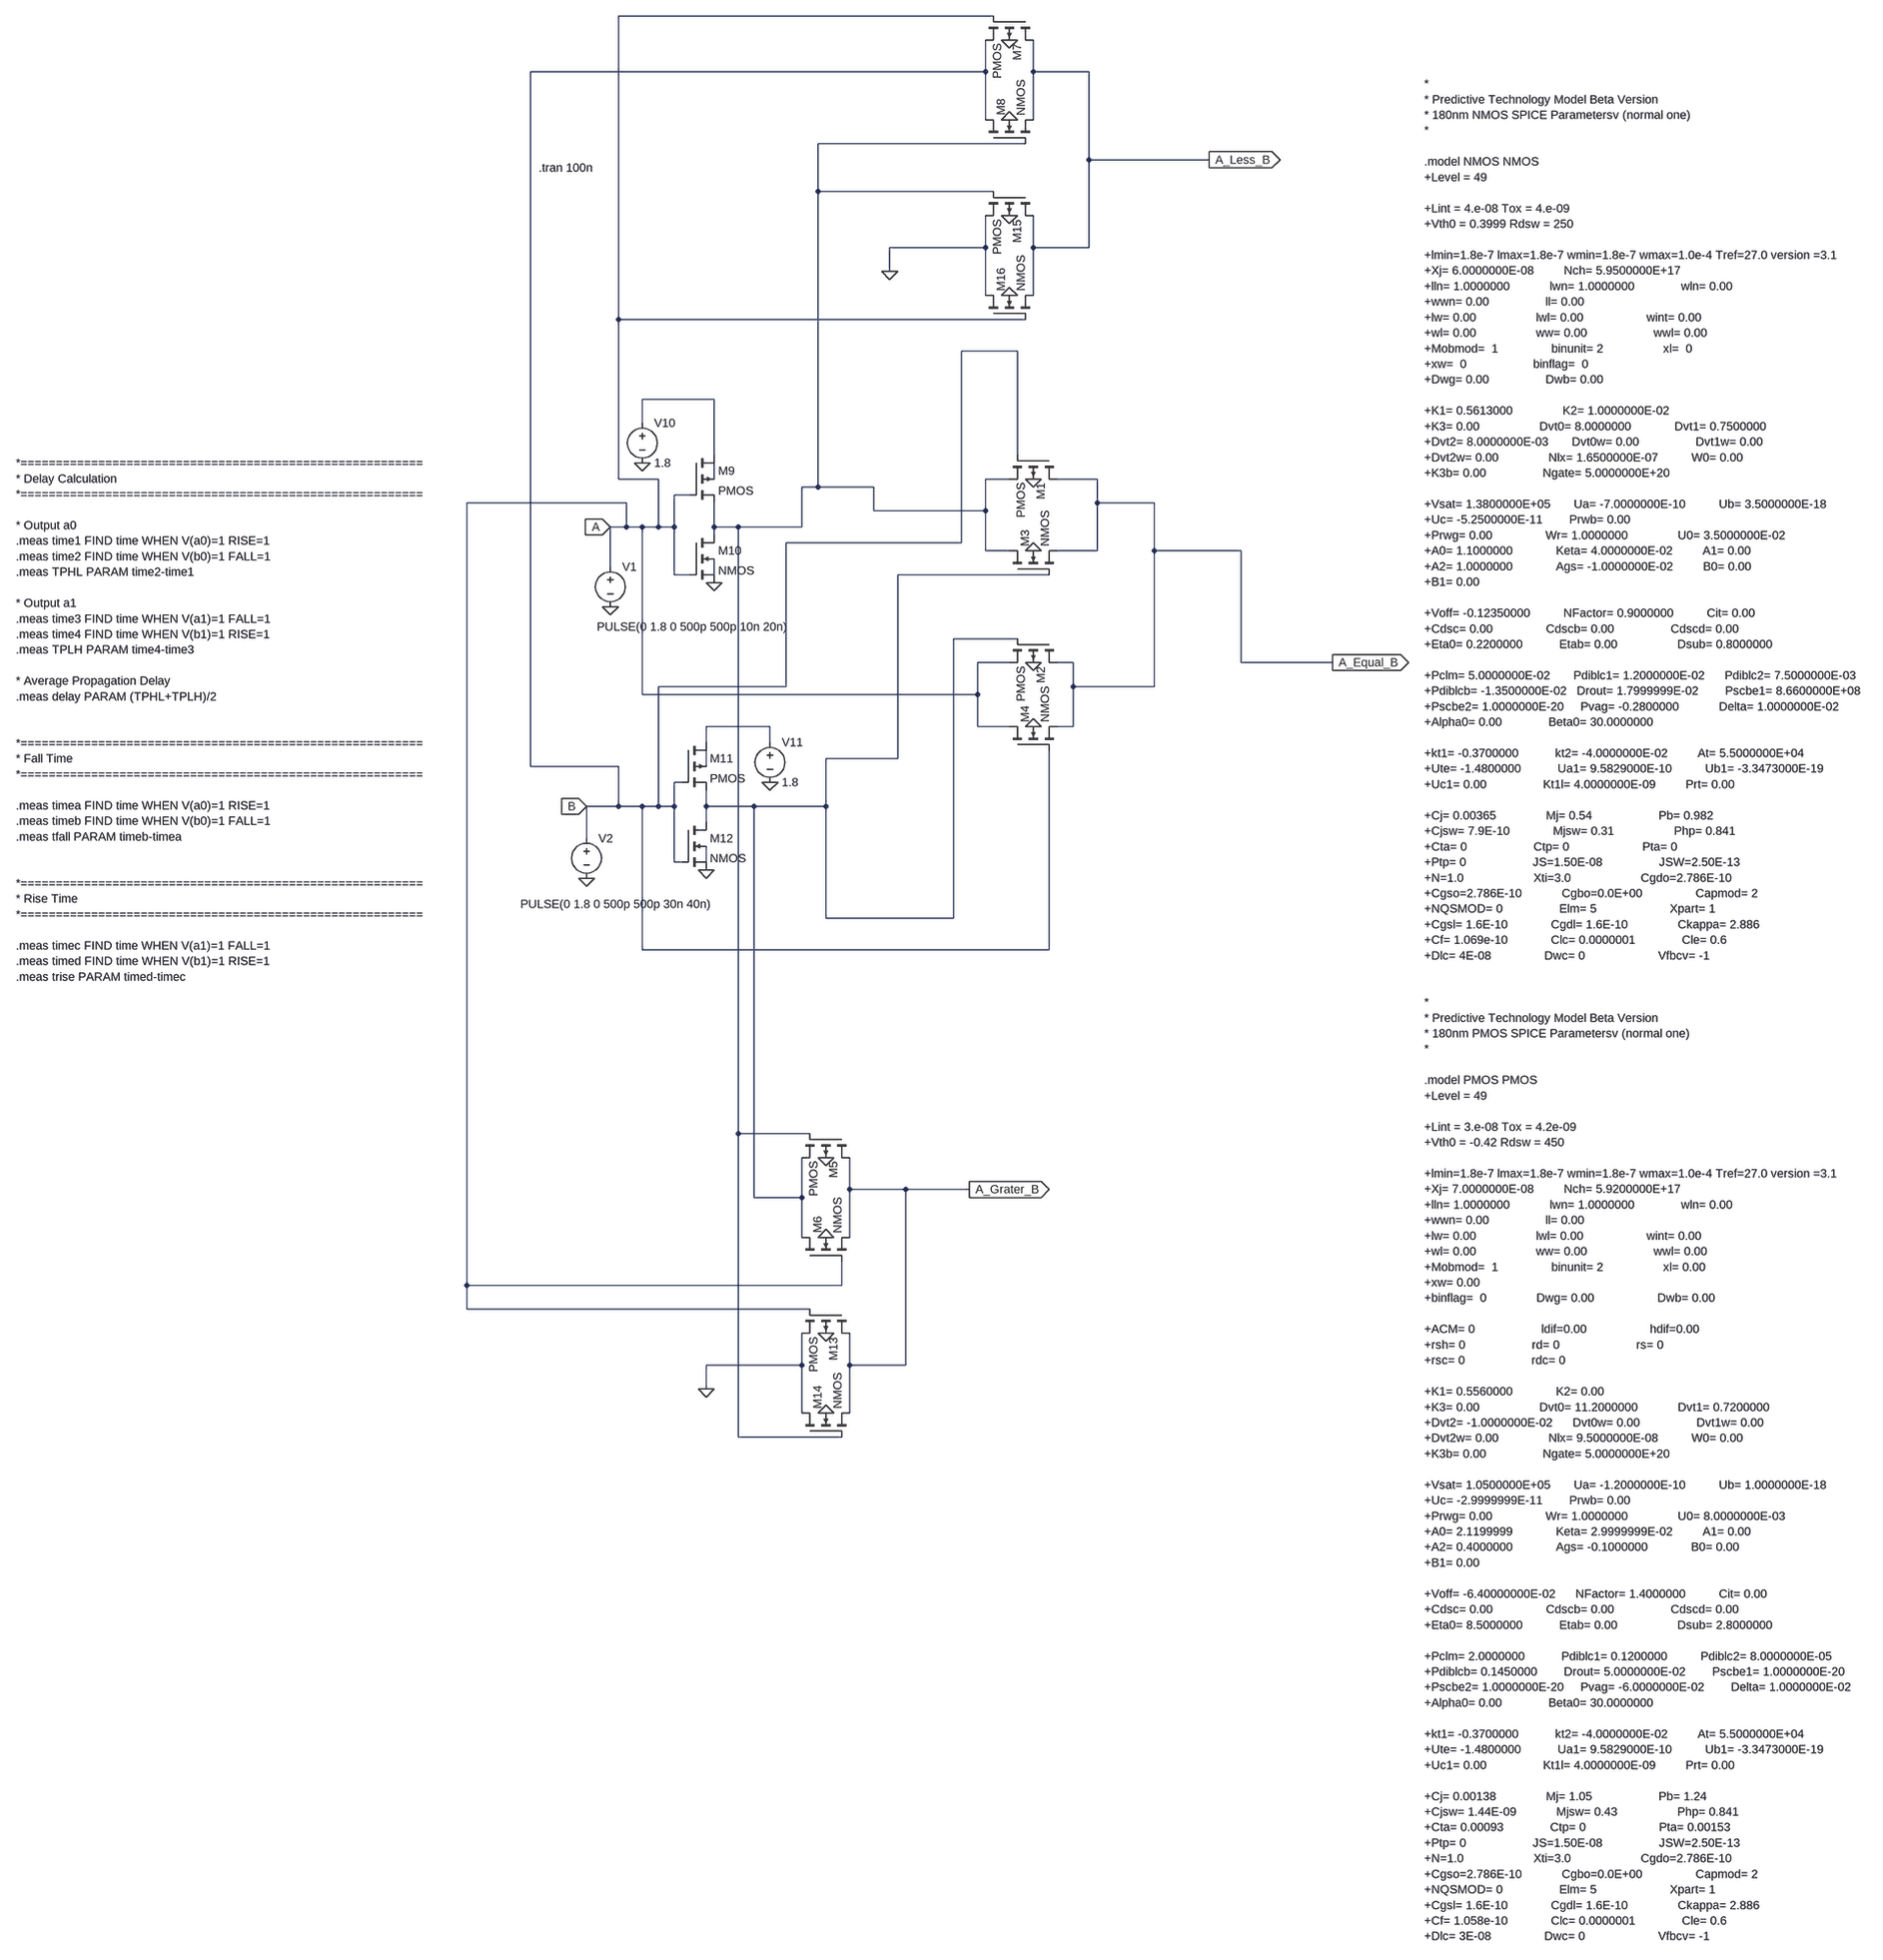
[diagram p0: schematic Comparator-tg-180nm.asc]
Comparator-tg-180nm.asc, the LTspice schematic file:
Version 4
SHEET 1 2256 1880
WIRE 160 -976 -592 -976
WIRE 144 -864 144 -928
WIRE 144 -864 -768 -864
WIRE 240 -864 240 -928
WIRE 352 -864 240 -864
WIRE 144 -768 144 -864
WIRE 240 -768 240 -864
WIRE 224 -720 -192 -720
WIRE 352 -688 352 -864
WIRE 816 -688 352 -688
WIRE -192 -624 -192 -720
WIRE 160 -624 -192 -624
WIRE 144 -512 144 -576
WIRE 144 -512 -48 -512
WIRE 240 -512 240 -576
WIRE 352 -512 352 -688
WIRE 352 -512 240 -512
WIRE -48 -464 -48 -512
WIRE 144 -416 144 -512
WIRE 240 -416 240 -512
WIRE -592 -368 -592 -976
WIRE 224 -368 -592 -368
WIRE 208 -304 96 -304
WIRE -400 -208 -544 -208
WIRE -544 -160 -544 -208
WIRE -400 -96 -400 -208
WIRE 208 -96 208 -304
WIRE -592 -48 -592 -368
WIRE -512 -48 -592 -48
WIRE -400 -48 -400 -80
WIRE 192 -48 144 -48
WIRE 368 -48 288 -48
WIRE -192 -32 -192 -624
WIRE -192 -32 -224 -32
WIRE -80 -32 -192 -32
WIRE -448 -16 -480 -16
WIRE -576 0 -896 0
WIRE 368 0 368 -48
WIRE 496 0 368 0
WIRE -80 16 -80 -32
WIRE 144 16 144 -48
WIRE 144 16 -80 16
WIRE -576 48 -576 0
WIRE -576 48 -608 48
WIRE -544 48 -576 48
WIRE -512 48 -512 -48
WIRE -512 48 -544 48
WIRE -480 48 -480 -16
WIRE -480 48 -512 48
WIRE -400 48 -400 0
WIRE -352 48 -400 48
WIRE -224 48 -224 -32
WIRE -224 48 -352 48
WIRE -400 64 -400 48
WIRE 96 80 96 -304
WIRE 96 80 -256 80
WIRE 144 96 144 16
WIRE 192 96 144 96
WIRE 368 96 368 0
WIRE 368 96 288 96
WIRE 496 96 496 0
WIRE 880 96 496 96
WIRE -608 128 -608 48
WIRE -480 144 -480 48
WIRE -448 144 -480 144
WIRE -400 144 -400 112
WIRE 272 144 -32 144
WIRE 208 272 80 272
WIRE 192 320 128 320
WIRE 320 320 288 320
WIRE 880 320 880 96
WIRE 1312 320 880 320
WIRE -256 368 -256 80
WIRE -256 368 -512 368
WIRE 320 368 320 320
WIRE 496 368 496 96
WIRE 496 368 320 368
WIRE -544 384 -544 48
WIRE 128 384 128 320
WIRE 128 384 -544 384
WIRE -288 448 -416 448
WIRE 128 448 128 384
WIRE 192 448 128 448
WIRE 320 448 320 368
WIRE 320 448 288 448
WIRE -416 480 -416 448
WIRE -288 480 -288 448
WIRE -32 512 -32 144
WIRE -32 512 -176 512
WIRE -768 528 -768 -864
WIRE -592 528 -768 528
WIRE -416 528 -416 496
WIRE -464 560 -480 560
WIRE -592 608 -592 528
WIRE -592 608 -656 608
WIRE -544 608 -592 608
WIRE -512 608 -512 368
WIRE -512 608 -544 608
WIRE -480 608 -480 560
WIRE -480 608 -512 608
WIRE -416 608 -416 576
WIRE -320 608 -416 608
WIRE -176 608 -176 512
WIRE -176 608 -320 608
WIRE -416 640 -416 608
WIRE -656 672 -656 608
WIRE -480 720 -480 608
WIRE -464 720 -480 720
WIRE -416 720 -416 688
WIRE -176 832 -176 608
WIRE 80 832 80 272
WIRE 80 832 -176 832
WIRE -544 896 -544 608
WIRE 272 896 272 496
WIRE 272 896 -544 896
WIRE -352 1264 -352 48
WIRE -208 1264 -352 1264
WIRE -128 1376 -128 1312
WIRE -16 1376 -128 1376
WIRE 112 1376 -16 1376
WIRE -320 1392 -320 608
WIRE -224 1392 -224 1312
WIRE -224 1392 -320 1392
WIRE -224 1472 -224 1392
WIRE -128 1472 -128 1376
WIRE -896 1568 -896 0
WIRE -144 1568 -144 1520
WIRE -144 1568 -896 1568
WIRE -896 1616 -896 1568
WIRE -208 1616 -896 1616
WIRE -224 1728 -224 1664
WIRE -224 1728 -416 1728
WIRE -128 1728 -128 1664
WIRE -16 1728 -16 1376
WIRE -16 1728 -128 1728
WIRE -416 1776 -416 1728
WIRE -224 1824 -224 1728
WIRE -128 1824 -128 1728
WIRE -352 1872 -352 1264
WIRE -144 1872 -352 1872
FLAG -416 736 0
FLAG -400 160 0
FLAG -608 208 0
FLAG -656 752 0
FLAG -608 48 A
IOPIN -608 48 In
FLAG -656 608 B
IOPIN -656 608 In
FLAG 816 -688 A_Less_B
IOPIN 816 -688 Out
FLAG -544 -80 0
FLAG -288 560 0
FLAG 112 1376 A_Grater_B
IOPIN 112 1376 Out
FLAG 1312 320 A_Equal_B
IOPIN 1312 320 Out
FLAG -416 1776 0
FLAG -48 -464 0
FLAG 192 -928 0
FLAG 192 -768 0
FLAG 192 -576 0
FLAG 192 -416 0
FLAG -176 1824 0
FLAG -176 1664 0
FLAG -176 1472 0
FLAG -176 1312 0
FLAG 240 -48 0
FLAG 240 96 0
FLAG 240 320 0
FLAG 240 448 0
SYMBOL pmos4 -448 -96 R0
SYMATTR InstName M9
SYMATTR Value2 l=180nm w=540nm
SYMBOL nmos4 -448 64 R0
SYMATTR InstName M10
SYMATTR Value2 l=180nm w=540nm
SYMBOL pmos4 -464 480 R0
SYMATTR InstName M11
SYMATTR Value2 l=180nm w=540nm
SYMBOL nmos4 -464 640 R0
SYMATTR InstName M12
SYMATTR Value2 l=180nm w=540nm
SYMBOL voltage -608 112 R0
WINDOW 3 -27 136 Left 2
WINDOW 123 0 0 Left 0
WINDOW 39 0 0 Left 0
SYMATTR Value PULSE(0 1.8 0 500p 500p 10n 20n)
SYMATTR InstName V1
SYMBOL voltage -656 656 R0
WINDOW 3 -132 148 Left 2
WINDOW 123 0 0 Left 0
WINDOW 39 0 0 Left 0
SYMATTR Value PULSE(0 1.8 0 500p 500p 30n 40n)
SYMATTR InstName V2
SYMBOL voltage -544 -176 R0
WINDOW 123 0 0 Left 0
WINDOW 39 0 0 Left 0
SYMATTR InstName V10
SYMATTR Value 1.8
SYMBOL voltage -288 464 R0
WINDOW 123 0 0 Left 0
WINDOW 39 0 0 Left 0
SYMATTR InstName V11
SYMATTR Value 1.8
SYMBOL pmos4 288 -96 R90
SYMATTR InstName M1
SYMATTR Value2 l=180nm w=540nm
SYMBOL pmos4 288 272 R90
SYMATTR InstName M2
SYMATTR Value2 l=180nm w=540nm
SYMBOL nmos4 192 144 R270
SYMATTR InstName M3
SYMATTR Value2 l=180nm w=540nm
SYMBOL nmos4 192 496 R270
SYMATTR InstName M4
SYMATTR Value2 l=180nm w=540nm
SYMBOL pmos4 -128 1264 R90
SYMATTR InstName M5
SYMATTR Value2 l=180nm w=540nm
SYMBOL nmos4 -224 1520 R270
SYMATTR InstName M6
SYMATTR Value2 l=180nm w=540nm
SYMBOL pmos4 -128 1616 R90
SYMATTR InstName M13
SYMATTR Value2 l=180nm w=540nm
SYMBOL nmos4 -224 1872 R270
SYMATTR InstName M14
SYMATTR Value2 l=180nm w=540nm
SYMBOL pmos4 240 -976 R90
SYMATTR InstName M7
SYMATTR Value2 l=180nm w=540nm
SYMBOL nmos4 144 -720 R270
SYMATTR InstName M8
SYMATTR Value2 l=180nm w=540nm
SYMBOL pmos4 240 -624 R90
SYMATTR InstName M15
SYMATTR Value2 l=180nm w=540nm
SYMBOL nmos4 144 -368 R270
SYMATTR InstName M16
SYMATTR Value2 l=180nm w=540nm
TEXT -752 -672 Left 2 !.tran 100n
TEXT -1800 -80 Left 2 !*=========================================================\n* Delay Calculation\n*=========================================================\n \n* Output a0\n.meas time1 FIND time WHEN V(a0)=1 RISE=1\n.meas time2 FIND time WHEN V(b0)=1 FALL=1\n.meas TPHL PARAM time2-time1\n \n* Output a1\n.meas time3 FIND time WHEN V(a1)=1 FALL=1\n.meas time4 FIND time WHEN V(b1)=1 RISE=1\n.meas TPLH PARAM time4-time3\n \n* Average Propagation Delay\n.meas delay PARAM (TPHL+TPLH)/2\n \n\n*=========================================================\n* Fall Time\n*=========================================================\n \n.meas timea FIND time WHEN V(a0)=1 RISE=1\n.meas timeb FIND time WHEN V(b0)=1 FALL=1\n.meas tfall PARAM timeb-timea\n \n\n*=========================================================\n* Rise Time\n*=========================================================\n \n.meas timec FIND time WHEN V(a1)=1 FALL=1\n.meas timed FIND time WHEN V(b1)=1 RISE=1\n.meas trise PARAM timed-timec
TEXT 1496 -840 Left 2 !*\n* Predictive Technology Model Beta Version\n* 180nm NMOS SPICE Parametersv (normal one)\n*\n \n.model NMOS NMOS\n+Level = 49\n \n+Lint = 4.e-08 Tox = 4.e-09 \n+Vth0 = 0.3999 Rdsw = 250 \n \n+lmin=1.8e-7 lmax=1.8e-7 wmin=1.8e-7 wmax=1.0e-4 Tref=27.0 version =3.1\n+Xj= 6.0000000E-08         Nch= 5.9500000E+17 \n+lln= 1.0000000            lwn= 1.0000000              wln= 0.00\n+wwn= 0.00                 ll= 0.00\n+lw= 0.00                  lwl= 0.00                   wint= 0.00\n+wl= 0.00                  ww= 0.00                    wwl= 0.00\n+Mobmod=  1                binunit= 2                  xl=  0\n+xw=  0                    binflag=  0\n+Dwg= 0.00                 Dwb= 0.00 \n \n+K1= 0.5613000               K2= 1.0000000E-02 \n+K3= 0.00                  Dvt0= 8.0000000             Dvt1= 0.7500000 \n+Dvt2= 8.0000000E-03       Dvt0w= 0.00                 Dvt1w= 0.00 \n+Dvt2w= 0.00               Nlx= 1.6500000E-07          W0= 0.00 \n+K3b= 0.00                 Ngate= 5.0000000E+20 \n \n+Vsat= 1.3800000E+05       Ua= -7.0000000E-10          Ub= 3.5000000E-18 \n+Uc= -5.2500000E-11        Prwb= 0.00 \n+Prwg= 0.00                Wr= 1.0000000               U0= 3.5000000E-02 \n+A0= 1.1000000             Keta= 4.0000000E-02         A1= 0.00 \n+A2= 1.0000000             Ags= -1.0000000E-02         B0= 0.00 \n+B1= 0.00 \n \n+Voff= -0.12350000          NFactor= 0.9000000          Cit= 0.00 \n+Cdsc= 0.00                Cdscb= 0.00                 Cdscd= 0.00 \n+Eta0= 0.2200000           Etab= 0.00                  Dsub= 0.8000000 \n \n+Pclm= 5.0000000E-02       Pdiblc1= 1.2000000E-02      Pdiblc2= 7.5000000E-03 \n+Pdiblcb= -1.3500000E-02   Drout= 1.7999999E-02        Pscbe1= 8.6600000E+08 \n+Pscbe2= 1.0000000E-20     Pvag= -0.2800000            Delta= 1.0000000E-02 \n+Alpha0= 0.00              Beta0= 30.0000000 \n \n+kt1= -0.3700000           kt2= -4.0000000E-02         At= 5.5000000E+04 \n+Ute= -1.4800000           Ua1= 9.5829000E-10          Ub1= -3.3473000E-19 \n+Uc1= 0.00                 Kt1l= 4.0000000E-09         Prt= 0.00 \n \n+Cj= 0.00365               Mj= 0.54                    Pb= 0.982\n+Cjsw= 7.9E-10             Mjsw= 0.31                  Php= 0.841\n+Cta= 0                    Ctp= 0                      Pta= 0\n+Ptp= 0                    JS=1.50E-08                 JSW=2.50E-13\n+N=1.0                     Xti=3.0                     Cgdo=2.786E-10\n+Cgso=2.786E-10            Cgbo=0.0E+00                Capmod= 2\n+NQSMOD= 0                 Elm= 5                      Xpart= 1\n+Cgsl= 1.6E-10             Cgdl= 1.6E-10               Ckappa= 2.886\n+Cf= 1.069e-10             Clc= 0.0000001              Cle= 0.6\n+Dlc= 4E-08                Dwc= 0                      Vfbcv= -1\n \n\n*\n* Predictive Technology Model Beta Version\n* 180nm PMOS SPICE Parametersv (normal one)\n*\n \n.model PMOS PMOS\n+Level = 49\n \n+Lint = 3.e-08 Tox = 4.2e-09 \n+Vth0 = -0.42 Rdsw = 450 \n \n+lmin=1.8e-7 lmax=1.8e-7 wmin=1.8e-7 wmax=1.0e-4 Tref=27.0 version =3.1\n+Xj= 7.0000000E-08         Nch= 5.9200000E+17 \n+lln= 1.0000000            lwn= 1.0000000              wln= 0.00\n+wwn= 0.00                 ll= 0.00\n+lw= 0.00                  lwl= 0.00                   wint= 0.00\n+wl= 0.00                  ww= 0.00                    wwl= 0.00\n+Mobmod=  1                binunit= 2                  xl= 0.00\n+xw= 0.00                  \n+binflag=  0               Dwg= 0.00                   Dwb= 0.00 \n \n+ACM= 0                    ldif=0.00                   hdif=0.00\n+rsh= 0                    rd= 0                       rs= 0\n+rsc= 0                    rdc= 0\n \n+K1= 0.5560000             K2= 0.00 \n+K3= 0.00                  Dvt0= 11.2000000            Dvt1= 0.7200000 \n+Dvt2= -1.0000000E-02      Dvt0w= 0.00                 Dvt1w= 0.00 \n+Dvt2w= 0.00               Nlx= 9.5000000E-08          W0= 0.00 \n+K3b= 0.00                 Ngate= 5.0000000E+20 \n \n+Vsat= 1.0500000E+05       Ua= -1.2000000E-10          Ub= 1.0000000E-18 \n+Uc= -2.9999999E-11        Prwb= 0.00 \n+Prwg= 0.00                Wr= 1.0000000               U0= 8.0000000E-03 \n+A0= 2.1199999             Keta= 2.9999999E-02         A1= 0.00 \n+A2= 0.4000000             Ags= -0.1000000             B0= 0.00 \n+B1= 0.00 \n \n+Voff= -6.40000000E-02      NFactor= 1.4000000          Cit= 0.00 \n+Cdsc= 0.00                Cdscb= 0.00                 Cdscd= 0.00 \n+Eta0= 8.5000000           Etab= 0.00                  Dsub= 2.8000000 \n \n+Pclm= 2.0000000           Pdiblc1= 0.1200000          Pdiblc2= 8.0000000E-05 \n+Pdiblcb= 0.1450000        Drout= 5.0000000E-02        Pscbe1= 1.0000000E-20 \n+Pscbe2= 1.0000000E-20     Pvag= -6.0000000E-02        Delta= 1.0000000E-02 \n+Alpha0= 0.00              Beta0= 30.0000000 \n \n+kt1= -0.3700000           kt2= -4.0000000E-02         At= 5.5000000E+04 \n+Ute= -1.4800000           Ua1= 9.5829000E-10          Ub1= -3.3473000E-19 \n+Uc1= 0.00                 Kt1l= 4.0000000E-09         Prt= 0.00 \n \n+Cj= 0.00138               Mj= 1.05                    Pb= 1.24\n+Cjsw= 1.44E-09            Mjsw= 0.43                  Php= 0.841\n+Cta= 0.00093              Ctp= 0                      Pta= 0.00153\n+Ptp= 0                    JS=1.50E-08                 JSW=2.50E-13\n+N=1.0                     Xti=3.0                     Cgdo=2.786E-10\n+Cgso=2.786E-10            Cgbo=0.0E+00                Capmod= 2\n+NQSMOD= 0                 Elm= 5                      Xpart= 1\n+Cgsl= 1.6E-10             Cgdl= 1.6E-10               Ckappa= 2.886\n+Cf= 1.058e-10             Clc= 0.0000001              Cle= 0.6\n+Dlc= 3E-08                Dwc= 0                      Vfbcv= -1

The netlist it stands for:
* Comparator-tg-180nm.asc
M9 N002 A N001 N003 PMOS l=180nm w=540nm
M10 N001 A 0 N004 NMOS l=180nm w=540nm
M11 N006 B N005 N007 PMOS l=180nm w=540nm
M12 N005 B 0 N008 NMOS l=180nm w=540nm
V1 A 0 PULSE(0 1.8 0 500p 500p 10n 20n)
V2 B 0 PULSE(0 1.8 0 500p 500p 30n 40n)
V10 N002 0 1.8
V11 N006 0 1.8
M1 A_Equal_B B N001 0 PMOS l=180nm w=540nm
M2 A_Equal_B N005 A 0 PMOS l=180nm w=540nm
M3 N001 N005 A_Equal_B 0 NMOS l=180nm w=540nm
M4 A B A_Equal_B 0 NMOS l=180nm w=540nm
M5 A_Grater_B N001 N005 0 PMOS l=180nm w=540nm
M6 N005 A A_Grater_B 0 NMOS l=180nm w=540nm
M13 A_Grater_B A 0 0 PMOS l=180nm w=540nm
M14 0 N001 A_Grater_B 0 NMOS l=180nm w=540nm
M7 A_Less_B A B 0 PMOS l=180nm w=540nm
M8 B N001 A_Less_B 0 NMOS l=180nm w=540nm
M15 A_Less_B N001 0 0 PMOS l=180nm w=540nm
M16 0 A A_Less_B 0 NMOS l=180nm w=540nm
.model NMOS NMOS
.model PMOS PMOS
.lib standard.mos
.tran 100n
*=========================================================
* Delay Calculation
*=========================================================
* Output a0
.meas time1 FIND time WHEN V(a0)=1 RISE=1
.meas time2 FIND time WHEN V(b0)=1 FALL=1
.meas TPHL PARAM time2-time1
* Output a1
.meas time3 FIND time WHEN V(a1)=1 FALL=1
.meas time4 FIND time WHEN V(b1)=1 RISE=1
.meas TPLH PARAM time4-time3
* Average Propagation Delay
.meas delay PARAM (TPHL+TPLH)/2
*=========================================================
* Fall Time
*=========================================================
.meas timea FIND time WHEN V(a0)=1 RISE=1
.meas timeb FIND time WHEN V(b0)=1 FALL=1
.meas tfall PARAM timeb-timea
*=========================================================
* Rise Time
*=========================================================
.meas timec FIND time WHEN V(a1)=1 FALL=1
.meas timed FIND time WHEN V(b1)=1 RISE=1
.meas trise PARAM timed-timec
*
* Predictive Technology Model Beta Version
* 180nm NMOS SPICE Parametersv (normal one)
*
.model NMOS NMOS
+Level = 49
+Lint = 4.e-08 Tox = 4.e-09
+Vth0 = 0.3999 Rdsw = 250
+lmin=1.8e-7 lmax=1.8e-7 wmin=1.8e-7 wmax=1.0e-4 Tref=27.0 version =3.1
+Xj= 6.0000000E-08         Nch= 5.9500000E+17
+lln= 1.0000000            lwn= 1.0000000              wln= 0.00
+wwn= 0.00                 ll= 0.00
+lw= 0.00                  lwl= 0.00                   wint= 0.00
+wl= 0.00                  ww= 0.00                    wwl= 0.00
+Mobmod=  1                binunit= 2                  xl=  0
+xw=  0                    binflag=  0
+Dwg= 0.00                 Dwb= 0.00
+K1= 0.5613000               K2= 1.0000000E-02
+K3= 0.00                  Dvt0= 8.0000000             Dvt1= 0.7500000
+Dvt2= 8.0000000E-03       Dvt0w= 0.00                 Dvt1w= 0.00
+Dvt2w= 0.00               Nlx= 1.6500000E-07          W0= 0.00
+K3b= 0.00                 Ngate= 5.0000000E+20
+Vsat= 1.3800000E+05       Ua= -7.0000000E-10          Ub= 3.5000000E-18
+Uc= -5.2500000E-11        Prwb= 0.00
+Prwg= 0.00                Wr= 1.0000000               U0= 3.5000000E-02
+A0= 1.1000000             Keta= 4.0000000E-02         A1= 0.00
+A2= 1.0000000             Ags= -1.0000000E-02         B0= 0.00
+B1= 0.00
+Voff= -0.12350000          NFactor= 0.9000000          Cit= 0.00
+Cdsc= 0.00                Cdscb= 0.00                 Cdscd= 0.00
+Eta0= 0.2200000           Etab= 0.00                  Dsub= 0.8000000
+Pclm= 5.0000000E-02       Pdiblc1= 1.2000000E-02      Pdiblc2= 7.5000000E-03
+Pdiblcb= -1.3500000E-02   Drout= 1.7999999E-02        Pscbe1= 8.6600000E+08
+Pscbe2= 1.0000000E-20     Pvag= -0.2800000            Delta= 1.0000000E-02
+Alpha0= 0.00              Beta0= 30.0000000
+kt1= -0.3700000           kt2= -4.0000000E-02         At= 5.5000000E+04
+Ute= -1.4800000           Ua1= 9.5829000E-10          Ub1= -3.3473000E-19
+Uc1= 0.00                 Kt1l= 4.0000000E-09         Prt= 0.00
+Cj= 0.00365               Mj= 0.54                    Pb= 0.982
+Cjsw= 7.9E-10             Mjsw= 0.31                  Php= 0.841
+Cta= 0                    Ctp= 0                      Pta= 0
+Ptp= 0                    JS=1.50E-08                 JSW=2.50E-13
+N=1.0                     Xti=3.0                     Cgdo=2.786E-10
+Cgso=2.786E-10            Cgbo=0.0E+00                Capmod= 2
+NQSMOD= 0                 Elm= 5                      Xpart= 1
+Cgsl= 1.6E-10             Cgdl= 1.6E-10               Ckappa= 2.886
+Cf= 1.069e-10             Clc= 0.0000001              Cle= 0.6
+Dlc= 4E-08                Dwc= 0                      Vfbcv= -1
*
* Predictive Technology Model Beta Version
* 180nm PMOS SPICE Parametersv (normal one)
*
.model PMOS PMOS
+Level = 49
+Lint = 3.e-08 Tox = 4.2e-09
+Vth0 = -0.42 Rdsw = 450
+lmin=1.8e-7 lmax=1.8e-7 wmin=1.8e-7 wmax=1.0e-4 Tref=27.0 version =3.1
+Xj= 7.0000000E-08         Nch= 5.9200000E+17
+lln= 1.0000000            lwn= 1.0000000              wln= 0.00
+wwn= 0.00                 ll= 0.00
+lw= 0.00                  lwl= 0.00                   wint= 0.00
+wl= 0.00                  ww= 0.00                    wwl= 0.00
+Mobmod=  1                binunit= 2                  xl= 0.00
+xw= 0.00
+binflag=  0               Dwg= 0.00                   Dwb= 0.00
+ACM= 0                    ldif=0.00                   hdif=0.00
+rsh= 0                    rd= 0                       rs= 0
+rsc= 0                    rdc= 0
+K1= 0.5560000             K2= 0.00
+K3= 0.00                  Dvt0= 11.2000000            Dvt1= 0.7200000
+Dvt2= -1.0000000E-02      Dvt0w= 0.00                 Dvt1w= 0.00
+Dvt2w= 0.00               Nlx= 9.5000000E-08          W0= 0.00
+K3b= 0.00                 Ngate= 5.0000000E+20
+Vsat= 1.0500000E+05       Ua= -1.2000000E-10          Ub= 1.0000000E-18
+Uc= -2.9999999E-11        Prwb= 0.00
+Prwg= 0.00                Wr= 1.0000000               U0= 8.0000000E-03
+A0= 2.1199999             Keta= 2.9999999E-02         A1= 0.00
+A2= 0.4000000             Ags= -0.1000000             B0= 0.00
+B1= 0.00
+Voff= -6.40000000E-02      NFactor= 1.4000000          Cit= 0.00
+Cdsc= 0.00                Cdscb= 0.00                 Cdscd= 0.00
+Eta0= 8.5000000           Etab= 0.00                  Dsub= 2.8000000
+Pclm= 2.0000000           Pdiblc1= 0.1200000          Pdiblc2= 8.0000000E-05
+Pdiblcb= 0.1450000        Drout= 5.0000000E-02        Pscbe1= 1.0000000E-20
+Pscbe2= 1.0000000E-20     Pvag= -6.0000000E-02        Delta= 1.0000000E-02
+Alpha0= 0.00              Beta0= 30.0000000
+kt1= -0.3700000           kt2= -4.0000000E-02         At= 5.5000000E+04
+Ute= -1.4800000           Ua1= 9.5829000E-10          Ub1= -3.3473000E-19
+Uc1= 0.00                 Kt1l= 4.0000000E-09         Prt= 0.00
+Cj= 0.00138               Mj= 1.05                    Pb= 1.24
+Cjsw= 1.44E-09            Mjsw= 0.43                  Php= 0.841
+Cta= 0.00093              Ctp= 0                      Pta= 0.00153
+Ptp= 0                    JS=1.50E-08                 JSW=2.50E-13
+N=1.0                     Xti=3.0                     Cgdo=2.786E-10
+Cgso=2.786E-10            Cgbo=0.0E+00                Capmod= 2
+NQSMOD= 0                 Elm= 5                      Xpart= 1
+Cgsl= 1.6E-10             Cgdl= 1.6E-10               Ckappa= 2.886
+Cf= 1.058e-10             Clc= 0.0000001              Cle= 0.6
+Dlc= 3E-08                Dwc= 0                      Vfbcv= -1
.backanno
.end